# Altium schematic sheet Flatsat_Connectors.SchDoc: Connectors
size A3
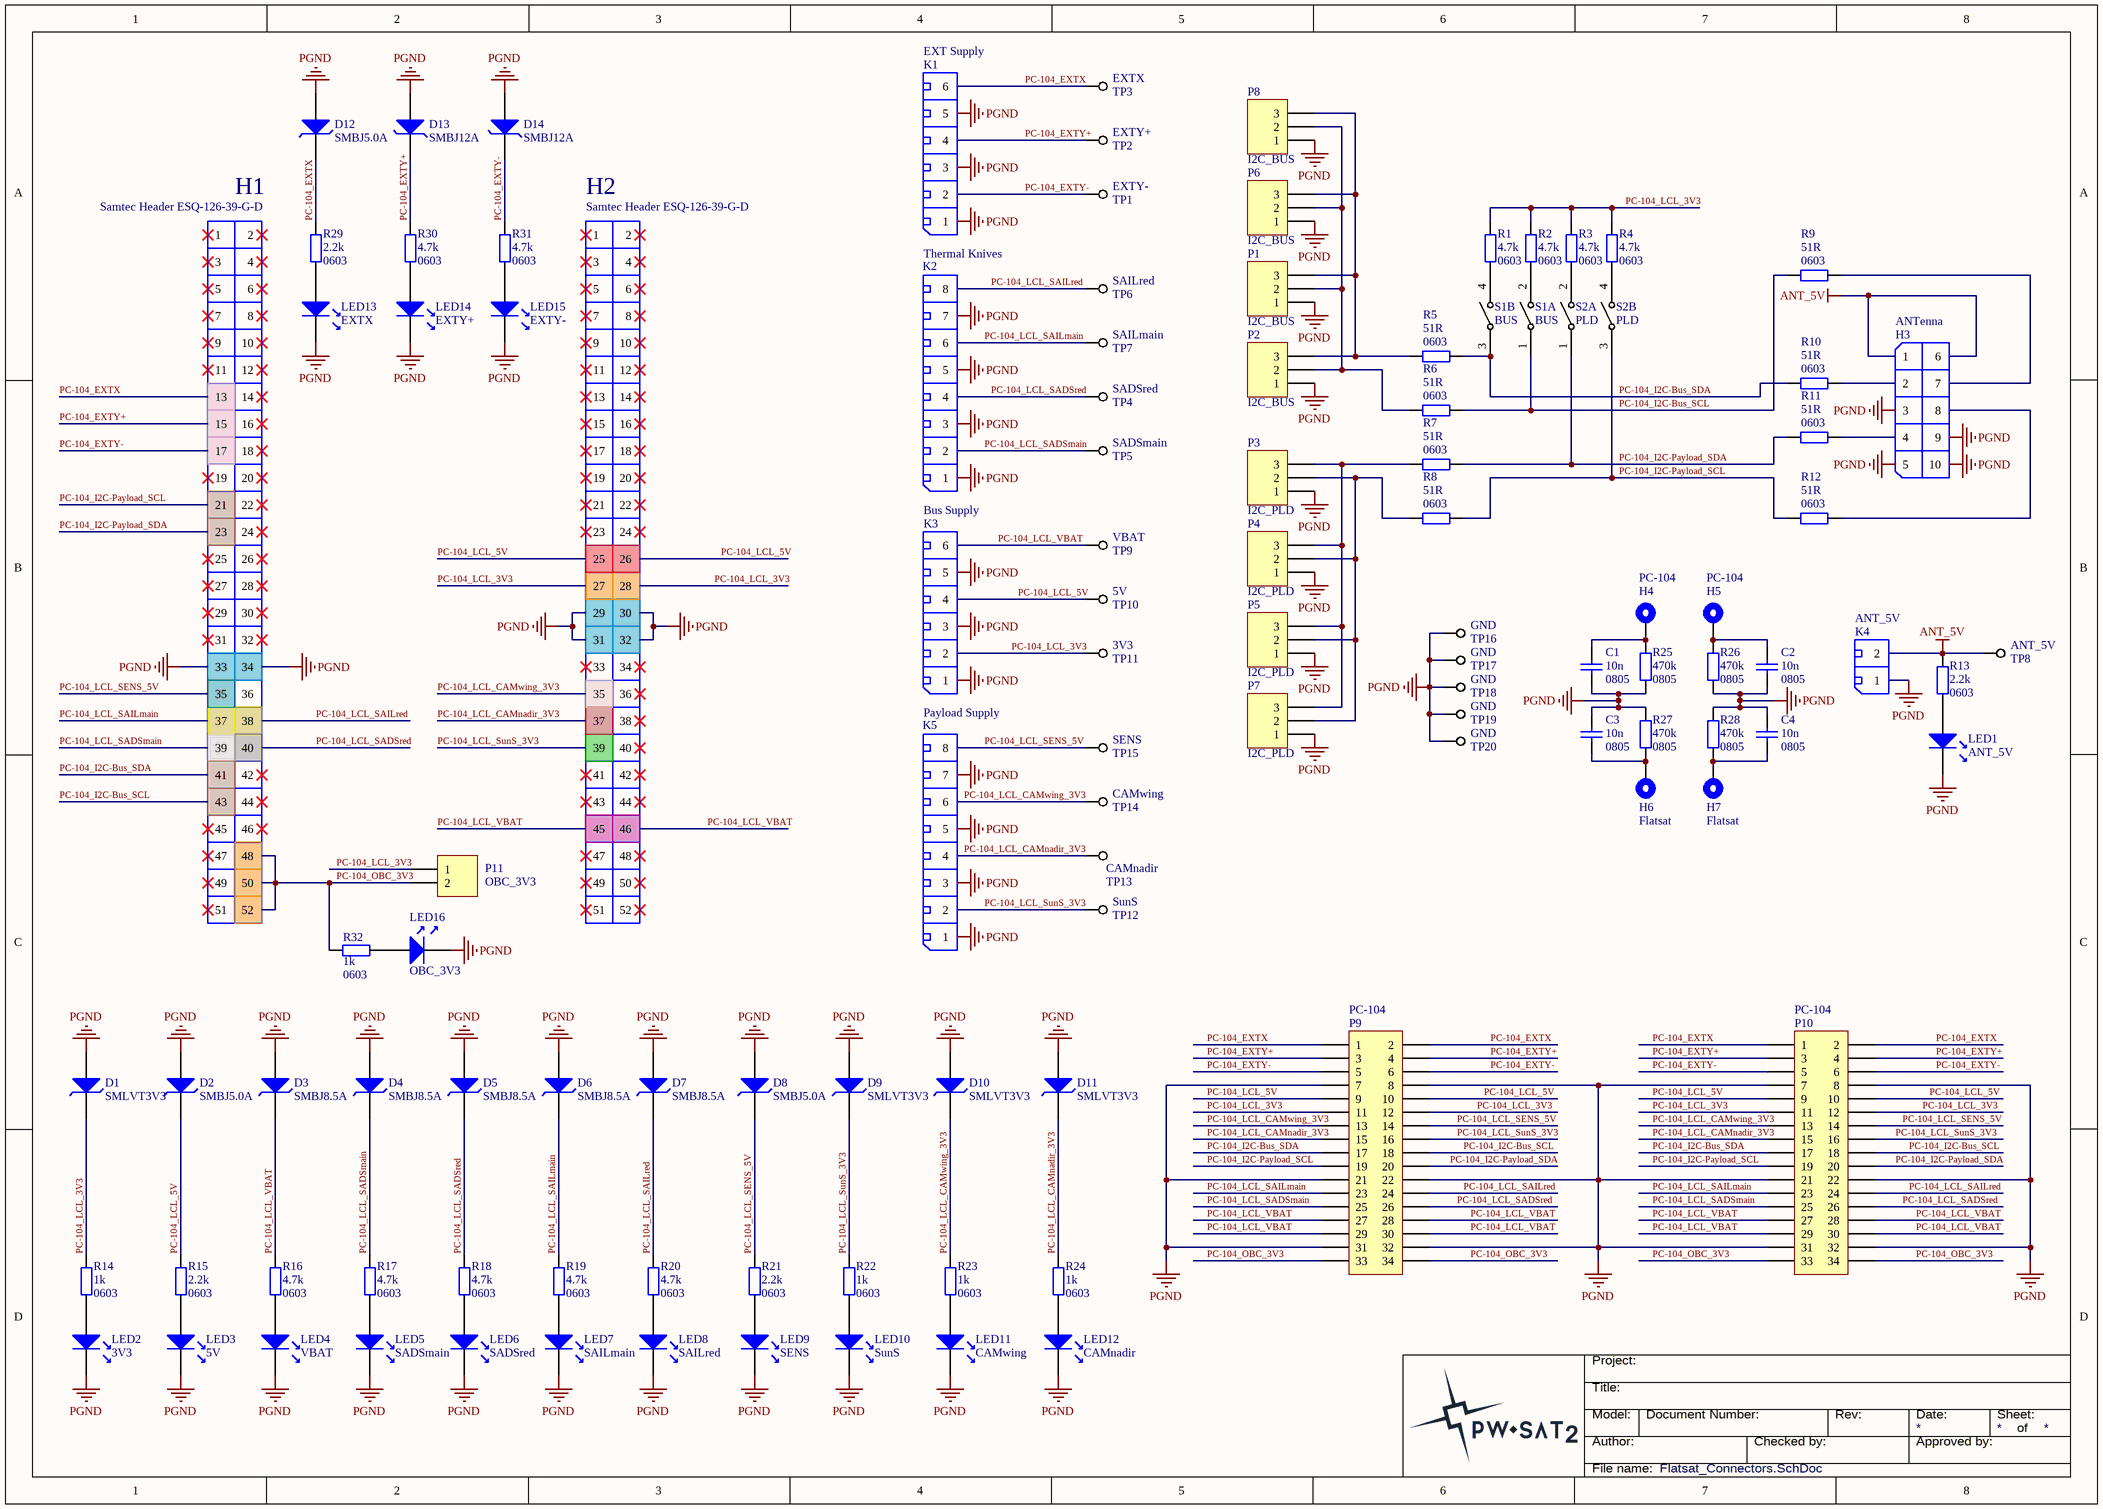
[diagram p0: Flatsat_Connectors.SchDoc]

## Parts
C1  value 10n  Package: 0805  [SMD_Capacitor_0805]  (hidden comment: Cap)
C2  value 10n  Package: 0805  [SMD_Capacitor_0805]  (hidden comment: Cap)
C3  value 10n  Package: 0805  [SMD_Capacitor_0805]  (hidden comment: Cap)
C4  value 10n  Package: 0805  [SMD_Capacitor_0805]  (hidden comment: Cap)
D1  SMLVT3V3  [DO-214AA]
D2  SMBJ5.0A  [DO-214AA]
D3  SMBJ8.5A  [DO-214AA]
D4  SMBJ8.5A  [DO-214AA]
D5  SMBJ8.5A  [DO-214AA]
D6  SMBJ8.5A  [DO-214AA]
D7  SMBJ8.5A  [DO-214AA]
D8  SMBJ5.0A  [DO-214AA]
D9  SMLVT3V3  [DO-214AA]
D10  SMLVT3V3  [DO-214AA]
D11  SMLVT3V3  [DO-214AA]
D12  SMBJ5.0A  [DO-214AA]
D13  SMBJ12A  [DO-214AA]
D14  SMBJ12A  [DO-214AA]
H1  Samtec Header ESQ-126-39-G-D  [Samtec_ESQ-126-39-G-D]
H2  Samtec Header ESQ-126-39-G-D  [Samtec_ESQ-126-39-G-D]
H3  ANTenna  [Harwin_Datamate_L-Tek_M80-8671005]
H4  PC-104  [PC-104_PcbMntHole_M3]
H5  PC-104  [PC-104_PcbMntHole_M3]
H6  Flatsat  [PC-104_PcbMntHole_M3]
H7  Flatsat  [PC-104_PcbMntHole_M3]
K1  EXT Supply  [TerminalBlock_Spring_2.54_6-R]
K2  Thermal Knives  [TerminalBlock_Spring_2.54_8-R]
K3  Bus Supply  [TerminalBlock_Spring_2.54_6-R]
K4  ANT_5V  [TerminalBlock_Spring_2.54_2-R]
K5  Payload Supply  [TerminalBlock_Spring_2.54_8-R]
LED1  ANT_5V  [SMD_LED_1206]
LED2  3V3  [SMD_LED_1206]
LED3  5V  [SMD_LED_1206]
LED4  VBAT  [SMD_LED_1206]
LED5  SADSmain  [SMD_LED_1206]
LED6  SADSred  [SMD_LED_1206]
LED7  SAILmain  [SMD_LED_1206]
LED8  SAILred  [SMD_LED_1206]
LED9  SENS  [SMD_LED_1206]
LED10  SunS  [SMD_LED_1206]
LED11  CAMwing  [SMD_LED_1206]
LED12  CAMnadir  [SMD_LED_1206]
LED13  EXTX  [SMD_LED_1206]
LED14  EXTY+  [SMD_LED_1206]
LED15  EXTY-  [SMD_LED_1206]
LED16  OBC_3V3  [SMD_LED_1206]
P1  I2C_BUS  [HEADER 1X3 MALE]
P2  I2C_BUS  [HEADER 1X3 MALE]
P3  I2C_PLD  [HEADER 1X3 MALE]
P4  I2C_PLD  [HEADER 1X3 MALE]
P5  I2C_PLD  [HEADER 1X3 MALE]
P6  I2C_BUS  [HEADER 1X3 MALE]
P7  I2C_PLD  [HEADER 1X3 MALE]
P8  I2C_BUS  [HEADER 1X3 MALE]
P9  PC-104  [IDC-34-Male-Socket]
P10  PC-104  [IDC-34-Male-Socket]
P11  OBC_3V3  [HEADER 1X2 Male]
R1  Package: 0603  [SMD_Resistor_0603]  (hidden comment: 4.7k)
R2  Package: 0603  [SMD_Resistor_0603]  (hidden comment: 4.7k)
R3  Package: 0603  [SMD_Resistor_0603]  (hidden comment: 4.7k)
R4  Package: 0603  [SMD_Resistor_0603]  (hidden comment: 4.7k)
R5  Package: 0603  [SMD_Resistor_0603]  (hidden comment: 51R)
R6  Package: 0603  [SMD_Resistor_0603]  (hidden comment: 51R)
R7  Package: 0603  [SMD_Resistor_0603]  (hidden comment: 51R)
R8  Package: 0603  [SMD_Resistor_0603]  (hidden comment: 51R)
R9  Package: 0603  [SMD_Resistor_0603]  (hidden comment: 51R)
R10  Package: 0603  [SMD_Resistor_0603]  (hidden comment: 51R)
R11  Package: 0603  [SMD_Resistor_0603]  (hidden comment: 51R)
R12  Package: 0603  [SMD_Resistor_0603]  (hidden comment: 51R)
R13  Package: 0603  [SMD_Resistor_0603]  (hidden comment: 2.2k)
R14  Package: 0603  [SMD_Resistor_0603]  (hidden comment: 1k)
R15  Package: 0603  [SMD_Resistor_0603]  (hidden comment: 2.2k)
R16  Package: 0603  [SMD_Resistor_0603]  (hidden comment: 4.7k)
R17  Package: 0603  [SMD_Resistor_0603]  (hidden comment: 4.7k)
R18  Package: 0603  [SMD_Resistor_0603]  (hidden comment: 4.7k)
R19  Package: 0603  [SMD_Resistor_0603]  (hidden comment: 4.7k)
R20  Package: 0603  [SMD_Resistor_0603]  (hidden comment: 4.7k)
R21  Package: 0603  [SMD_Resistor_0603]  (hidden comment: 2.2k)
R22  Package: 0603  [SMD_Resistor_0603]  (hidden comment: 1k)
R23  Package: 0603  [SMD_Resistor_0603]  (hidden comment: 1k)
R24  Package: 0603  [SMD_Resistor_0603]  (hidden comment: 1k)
R25  Package: 0805  [SMD_Resistor_0805]  (hidden comment: 470k)
R26  Package: 0805  [SMD_Resistor_0805]  (hidden comment: 470k)
R27  Package: 0805  [SMD_Resistor_0805]  (hidden comment: 470k)
R28  Package: 0805  [SMD_Resistor_0805]  (hidden comment: 470k)
R29  Package: 0603  [SMD_Resistor_0603]  (hidden comment: 2.2k)
R30  Package: 0603  [SMD_Resistor_0603]  (hidden comment: 4.7k)
R31  Package: 0603  [SMD_Resistor_0603]  (hidden comment: 4.7k)
R32  Package: 0603  [SMD_Resistor_0603]  (hidden comment: 1k)
S1  BUS  [MCEPM-02]  (parts A,B of 2)
S2  PLD  [MCEPM-02]  (parts A,B of 2)
TP1  EXTY-  [Testpoint-1pin]
TP2  EXTY+  [Testpoint-1pin]
TP3  EXTX  [Testpoint-1pin]
TP4  SADSred  [Testpoint-1pin]
TP5  SADSmain  [Testpoint-1pin]
TP6  SAILred  [Testpoint-1pin]
TP7  SAILmain  [Testpoint-1pin]
TP8  ANT_5V  [Testpoint-1pin]
TP9  VBAT  [Testpoint-1pin]
TP10  5V  [Testpoint-1pin]
TP11  3V3  [Testpoint-1pin]
TP12  SunS  [Testpoint-1pin]
TP13  CAMnadir  [Testpoint-1pin]
TP14  CAMwing  [Testpoint-1pin]
TP15  SENS  [Testpoint-1pin]
TP16  GND  [Testpoint-1pin]
TP17  GND  [Testpoint-1pin]
TP18  GND  [Testpoint-1pin]
TP19  GND  [Testpoint-1pin]
TP20  GND  [Testpoint-1pin]

## Nets
ANT_5V: H3.1 H3.6 K4.2 R13.1 TP8.1(TP)
PGND: C1.2 C2.2 C3.2 C4.2 D1.A D2.A D3.A D4.A D5.A D6.A D7.A D8.A D9.A D10.A D11.A D12.A D13.A D14.A H1.33 H1.34 H2.29 H2.30 H2.31 H2.32 H3.3 H3.5 H3.9 H3.10 K1.1 K1.3 K1.5 K2.1 K2.3 K2.5 K2.7 K3.1 K3.3 K3.5 K4.1 K5.1 K5.3 K5.5 K5.7 LED1.K LED2.K LED3.K LED4.K LED5.K LED6.K LED7.K LED8.K LED9.K LED10.K LED11.K LED12.K LED13.K LED14.K LED15.K LED16.K P1.1 P2.1 P3.1 P4.1 P5.1 P6.1 P7.1 P8.1 P9.7 P9.8 P9.21 P9.22 P9.31 P9.32 P10.7 P10.8 P10.21 P10.22 P10.31 P10.32 R25.2 R26.2 R27.2 R28.2 TP16.1(TP) TP17.1(TP) TP18.1(TP) TP19.1(TP) TP20.1(TP)
PC-104_EXTX: D12.K H1.13 K1.6 P9.1 P9.2 P10.1 P10.2 R29.1 TP3.1(TP)
PC-104_EXTY+: D13.K H1.15 K1.4 P9.3 P9.4 P10.3 P10.4 R30.1 TP2.1(TP)
PC-104_EXTY-: D14.K H1.17 K1.2 P9.5 P9.6 P10.5 P10.6 R31.1 TP1.1(TP)
PC-104_I2C-Bus_SCL: H1.43 P9.18 P10.18 R6.2 R9.1 S1.1
PC-104_I2C-Bus_SDA: H1.41 P9.17 P10.17 R5.2 R10.1 S1.3
PC-104_I2C-Payload_SCL: H1.21 P9.19 P10.19 R8.2 R12.1 S2.3
PC-104_I2C-Payload_SDA: H1.23 P9.20 P10.20 R7.2 R11.1 S2.1
PC-104_LCL_3V3: D1.K H2.27 H2.28 K3.2 P9.11 P9.12 P10.11 P10.12 P11.1 R1.1 R2.1 R3.1 R4.1 R14.1 TP11.1(TP)
PC-104_LCL_5V: D2.K H2.25 H2.26 K3.4 P9.9 P9.10 P10.9 P10.10 R15.1 TP10.1(TP)
PC-104_LCL_CAMnadir_3V3: D11.K H2.37 K5.4 P9.15 P10.15 R24.1 TP13.1(TP)
PC-104_LCL_CAMwing_3V3: D10.K H2.35 K5.6 P9.13 P10.13 R23.1 TP14.1(TP)
PC-104_LCL_SADSmain: D4.K H1.39 K2.2 P9.25 P10.25 R17.1 TP5.1(TP)
PC-104_LCL_SADSred: D5.K H1.40 K2.4 P9.26 P10.26 R18.1 TP4.1(TP)
PC-104_LCL_SAILmain: D6.K H1.37 K2.6 P9.23 P10.23 R19.1 TP7.1(TP)
PC-104_LCL_SAILred: D7.K H1.38 K2.8 P9.24 P10.24 R20.1 TP6.1(TP)
PC-104_LCL_SENS_5V: D8.K H1.35 K5.8 P9.14 P10.14 R21.1 TP15.1(TP)
PC-104_LCL_SunS_3V3: D9.K H2.39 K5.2 P9.16 P10.16 R22.1 TP12.1(TP)
PC-104_LCL_VBAT: D3.K H2.45 H2.46 K3.6 P9.27 P9.28 P9.29 P9.30 P10.27 P10.28 P10.29 P10.30 R16.1 TP9.1(TP)
PC-104_OBC_3V3: H1.48 H1.50 H1.52 P9.33 P9.34 P10.33 P10.34 P11.2 R32.1
NetC1_1: C1.1 H4.1 R25.1
NetC2_1: C2.1 H5.1 R26.1
NetC3_1: C3.1 H6.1 R27.1
NetC4_1: C4.1 H7.1 R28.1
NetH3_2: H3.2 R10.2
NetH3_4: H3.4 R11.2
NetH3_7: H3.7 R9.2
NetH3_8: H3.8 R12.2
NetLED1_A: LED1.A R13.2
NetLED2_A: LED2.A R14.2
NetLED3_A: LED3.A R15.2
NetLED4_A: LED4.A R16.2
NetLED5_A: LED5.A R17.2
NetLED6_A: LED6.A R18.2
NetLED7_A: LED7.A R19.2
NetLED8_A: LED8.A R20.2
NetLED9_A: LED9.A R21.2
NetLED10_A: LED10.A R22.2
NetLED11_A: LED11.A R23.2
NetLED12_A: LED12.A R24.2
NetLED13_A: LED13.A R29.2
NetLED14_A: LED14.A R30.2
NetLED15_A: LED15.A R31.2
NetLED16_A: LED16.A R32.2
NetP1_2: P1.2 P2.2 P6.2 P8.2 R6.1
NetP1_3: P1.3 P2.3 P6.3 P8.3 R5.1
NetP3_2: P3.2 P4.2 P5.2 P7.2 R8.1
NetP3_3: P3.3 P4.3 P5.3 P7.3 R7.1
NetR1_2: R1.2 S1.4
NetR2_2: R2.2 S1.2
NetR3_2: R3.2 S2.2
NetR4_2: R4.2 S2.4

Not connected (* = marked no-connect by the designer): H1 1* 2* 3* 4* 5* 6* 7* 8* 9* 10* 11* 12* 14* 16* 18* 19* 20* 22* 24* 25* 26* 27* 28* 29* 30* 31* 32* 36 42* 44* 45* 46* 47* 49* 51*; H2 1* 2* 3* 4* 5* 6* 7* 8* 9* 10* 11* 12* 13* 14* 15* 16* 17* 18* 19* 20* 21* 22* 23* 24* 33* 34* 36* 38* 40* 41* 42* 43* 44* 47* 48* 49* 50* 51* 52*

## Notes on the sheet
- Title:
- Project:
- Author:
- Model:
- Document Number:
- Checked by:
- Rev:
- Date:
- Approved by:
- Sheet:
- of
- File name:

## Library data of the parts
D1 D9-D11 = SMLVT3V3: Low voltage Transil 3.3V; Manufacturer: STMicroelectronics; HelpUrl: http://www.tme.eu/pl/Document/654e93f22e9bd1a3be2718a9a326b374/SMLVT3V3.pdf; Supplier 1: TME; TME: SMLVT3V3; Value: SMLVT3V3
D2 D8 D12 = SMBJ5.0A: Transil 5V; Manufacturer: STMicroelectronics; Supplier 1: TME; TME: SMBJ5.0A-TR; HelpUrl: http://www.tme.eu/pl/Document/3ca73e787117e5922dd0ae20e48304b9/SMBJ5.0A-TR.pdf; Value: SMBJ5.0A
D3-D7 = SMBJ8.5A: Transient Voltage Suppression Diodes 8.5V; Manufacturer: Littelfuse; HelpUrl: http://www.tme.eu/pl/Document/757bbc6bd363b88ac75c546b0f817d3b/Littelfuse_TVS-Diode_SMBJ.pdf; Supplier 1: TME; TME: SMBJ8.5A-LF; Value: SMBJ8.5A
D13 D14 = SMBJ12A: Transil 12V; Manufacturer: Littelfuse; HelpUrl: http://www.tme.eu/pl/Document/757bbc6bd363b88ac75c546b0f817d3b/Littelfuse_TVS-Diode_SMBJ.pdf; TME: SMBJ12A-LF; Supplier 1: TME; Value: SMBJ12A
H1 H2 = Samtec_ESQ-126-xx-x-D: Samtec ESQ Series Header , 2.54mm pitch, 2x26pin. PC-104 Stack Connector.; HelpUrl: http://suddendocs.samtec.com/catalog_english/esq_th.pdf; Value: Samtec Header ESQ-126-39-G-D
H3 = Harwin_Datamate_L-Tek_2x5pin: Harwin DataMate L-Tek, 2mm pitch, 2x5pin.; Value: Harwin DataMate L-Tek 2x5pin
H4-H7 = MntHole: PCB Mounting Hole; Value: Mounting Hole
K1 K3 = TerminalBlock_Spring_2.54_6-R: Terminal block with spring, 6-pin, 2.54mm pitch, right angle.; ProviderPartNumber: TB-2.5-PD-xx; Provider: TME.eu
  K1: Value: EXT Supply
  K3: Value: Bus Supply
K2 K5 = TerminalBlock_Spring_2.54_8-R: Terminal block with spring, 8-pin, 2.54mm pitch, right angle.; ProviderPartNumber: TB-2.5-PD-xx; Provider: TME.eu
  K2: Value: Thermal Knives
  K5: Value: Payload Supply
K4 = TerminalBlock_Spring_2.54_2-R: Terminal block with spring, 2-pin, 2.54mm pitch, right angle.; ProviderPartNumber: TB-2.5-PD-xx; Provider: TME.eu; Value: ANT_5V
LED1-LED16 = LED-1206_RED: LED diode, SMD1206 package.
  LED1: Value: ANT_5V
  LED2: Value: 3V3
  LED3: Value: 5V
  LED4: Value: VBAT
  LED5: Value: SADSmain
  LED6: Value: SADSred
  LED7: Value: SAILmain
  LED8: Value: SAILred
  LED9: Value: SENS
  LED10: Value: SunS
  LED11: Value: CAMwing
  LED12: Value: CAMnadir
  LED13: Value: EXTX
  LED14: Value: EXTY+
  LED15: Value: EXTY-
  LED16: Value: OBC_3V3
P1-P8 = Header 3: Header, 3-Pin; LatestRevisionDate: 17-Jul-2002; LatestRevisionNote: Re-released for DXP Platform.; Publisher: Altium Limited
P9 P10 = Header 17X2: Header, 17-Pin, Dual row; LatestRevisionDate: 17-Jul-2002; LatestRevisionNote: Re-released for DXP Platform.; Publisher: Altium Limited
P11 = Header 2: Header, 2-Pin; LatestRevisionDate: 17-Jul-2002; LatestRevisionNote: Re-released for DXP Platform.; Publisher: Altium Limited
R1-R32 = Res
  R1-R4 R16-R20 R30 R31: Value: 4.7k
  R5-R12: Value: 51R
  R13 R15 R21 R29: Value: 2.2k
  R14 R22-R24 R32: Value: 1k
  R25-R28: Value: 470k
S1 S2 = MCEPM-02: Supplier 1: Farnell
TP1-TP20 = Testpoint